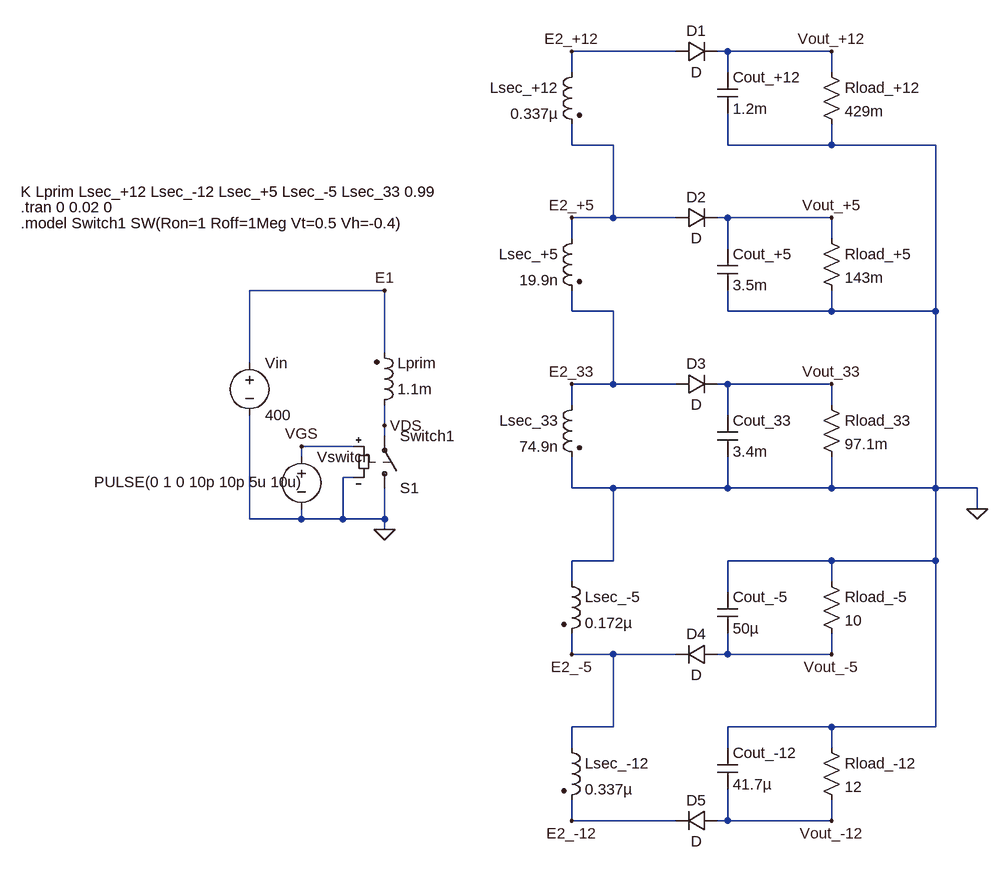
[diagram p0: schematic BasicFlyBack_AllRails_Stacked.asc]
BasicFlyBack_AllRails_Stacked.asc, the LTspice schematic file:
Version 4
SHEET 1 880 1456
WIRE 176 -208 16 -208
WIRE 256 -208 240 -208
WIRE 416 -208 256 -208
WIRE 16 -176 16 -208
WIRE 256 -176 256 -208
WIRE 416 -176 416 -208
WIRE 16 -64 16 -96
WIRE 80 -64 16 -64
WIRE 256 -64 256 -112
WIRE 416 -64 416 -96
WIRE 416 -64 256 -64
WIRE 576 -64 416 -64
WIRE 80 48 80 -64
WIRE 80 48 16 48
WIRE 176 48 80 48
WIRE 256 48 240 48
WIRE 416 48 256 48
WIRE 16 80 16 48
WIRE 416 80 416 48
WIRE 256 96 256 48
WIRE -272 160 -480 160
WIRE 16 192 16 160
WIRE 80 192 16 192
WIRE 256 192 256 160
WIRE 416 192 416 160
WIRE 416 192 256 192
WIRE 576 192 576 -64
WIRE 576 192 416 192
WIRE -272 256 -272 160
WIRE -480 272 -480 160
WIRE 80 304 80 192
WIRE 80 304 16 304
WIRE 176 304 80 304
WIRE 256 304 240 304
WIRE 416 304 256 304
WIRE 16 336 16 304
WIRE 416 336 416 304
WIRE 256 352 256 304
WIRE -272 368 -272 336
WIRE -272 384 -272 368
WIRE -320 400 -400 400
WIRE -400 416 -400 400
WIRE -320 448 -336 448
WIRE 16 464 16 416
WIRE 80 464 16 464
WIRE 256 464 256 416
WIRE 256 464 80 464
WIRE 416 464 416 416
WIRE 416 464 256 464
WIRE 576 464 576 192
WIRE 576 464 416 464
WIRE 640 464 576 464
WIRE 640 496 640 464
WIRE -480 512 -480 352
WIRE -400 512 -400 496
WIRE -400 512 -480 512
WIRE -336 512 -336 448
WIRE -336 512 -400 512
WIRE -272 512 -272 464
WIRE -272 512 -336 512
WIRE -272 528 -272 512
WIRE 80 576 80 464
WIRE 80 576 16 576
WIRE 416 576 256 576
WIRE 576 576 576 464
WIRE 576 576 416 576
WIRE 16 608 16 576
WIRE 416 608 416 576
WIRE 256 624 256 576
WIRE 16 720 16 688
WIRE 80 720 16 720
WIRE 176 720 80 720
WIRE 256 720 256 688
WIRE 256 720 240 720
WIRE 416 720 416 688
WIRE 416 720 256 720
WIRE 80 832 80 720
WIRE 80 832 16 832
WIRE 416 832 256 832
WIRE 576 832 576 576
WIRE 576 832 416 832
WIRE 16 864 16 832
WIRE 256 864 256 832
WIRE 416 864 416 832
WIRE 16 976 16 944
WIRE 176 976 16 976
WIRE 256 976 256 928
WIRE 256 976 240 976
WIRE 416 976 416 944
WIRE 416 976 256 976
FLAG -272 528 0
FLAG -272 160 E1
FLAG 16 -208 E2_+12
FLAG 16 48 E2_+5
FLAG 16 304 E2_33
FLAG 416 -208 Vout_+12
FLAG 416 48 Vout_+5
FLAG 416 304 Vout_33
FLAG -400 400 VGS
FLAG -272 368 VDS
FLAG 16 720 E2_-5
FLAG 416 720 Vout_-5
FLAG 16 976 E2_-12
FLAG 416 976 Vout_-12
FLAG 640 496 0
SYMBOL voltage -480 256 R0
SYMATTR InstName Vin
SYMATTR Value 400
SYMBOL ind2 -288 352 M180
WINDOW 0 36 80 Left 2
WINDOW 3 36 40 Left 2
SYMATTR InstName Lprim
SYMATTR Value 1.1m
SYMATTR Type ind
SYMATTR SpiceLine Rser=1m
SYMBOL ind2 32 -192 M0
SYMATTR InstName Lsec_+12
SYMATTR Value 0.337µ
SYMATTR Type ind
SYMATTR SpiceLine Rser=1m
SYMBOL ind2 32 64 M0
SYMATTR InstName Lsec_+5
SYMATTR Value 19.9n
SYMATTR Type ind
SYMATTR SpiceLine Rser=1m
SYMBOL ind2 32 320 M0
SYMATTR InstName Lsec_33
SYMATTR Value 74.9n
SYMATTR Type ind
SYMATTR SpiceLine Rser=1m
SYMBOL sw -272 480 M180
SYMATTR InstName S1
SYMATTR Value Switch1
SYMBOL voltage -400 400 R0
WINDOW 3 -319 55 Left 2
WINDOW 123 0 0 Left 0
WINDOW 39 0 0 Left 0
SYMATTR Value PULSE(0 1 0 10p 10p 5u 10u)
SYMATTR InstName Vswitch
SYMBOL res 400 -192 R0
SYMATTR InstName Rload_+12
SYMATTR Value 429m
SYMBOL res 400 64 R0
SYMATTR InstName Rload_+5
SYMATTR Value 143m
SYMBOL res 400 320 R0
SYMATTR InstName Rload_33
SYMATTR Value 97.1m
SYMBOL cap 240 352 R0
SYMATTR InstName Cout_33
SYMATTR Value 3.4m
SYMBOL cap 240 96 R0
SYMATTR InstName Cout_+5
SYMATTR Value 3.5m
SYMBOL cap 240 -176 R0
SYMATTR InstName Cout_+12
SYMATTR Value 1.2m
SYMBOL diode 176 -192 R270
WINDOW 0 32 32 VTop 2
WINDOW 3 0 32 VBottom 2
SYMATTR InstName D1
SYMBOL diode 176 64 R270
WINDOW 0 32 32 VTop 2
WINDOW 3 0 32 VBottom 2
SYMATTR InstName D2
SYMBOL diode 176 320 R270
WINDOW 0 32 32 VTop 2
WINDOW 3 0 32 VBottom 2
SYMATTR InstName D3
SYMBOL res 400 592 R0
SYMATTR InstName Rload_-5
SYMATTR Value 10
SYMBOL cap 240 624 R0
SYMATTR InstName Cout_-5
SYMATTR Value 50µ
SYMBOL diode 240 704 R90
WINDOW 0 0 32 VBottom 2
WINDOW 3 32 32 VTop 2
SYMATTR InstName D4
SYMBOL res 400 848 R0
SYMATTR InstName Rload_-12
SYMATTR Value 12
SYMBOL cap 240 864 R0
SYMATTR InstName Cout_-12
SYMATTR Value 41.7µ
SYMBOL diode 240 960 R90
WINDOW 0 0 32 VBottom 2
WINDOW 3 32 32 VTop 2
SYMATTR InstName D5
SYMBOL ind2 0 592 R0
SYMATTR InstName Lsec_-5
SYMATTR Value 0.172µ
SYMATTR Type ind
SYMBOL ind2 0 848 R0
SYMATTR InstName Lsec_-12
SYMATTR Value 0.337µ
SYMATTR Type ind
TEXT -832 8 Left 2 !K Lprim Lsec_+12 Lsec_-12 Lsec_+5 Lsec_-5 Lsec_33 0.99
TEXT -832 32 Left 2 !.tran 0 0.02 0
TEXT -832 56 Left 2 !.model Switch1 SW(Ron=1 Roff=1Meg Vt=0.5 Vh=-0.4)

The netlist it stands for:
* BasicFlyBack_AllRails_Stacked.asc
Vin E1 0 400
Lprim VDS E1 1.1m Rser=1m
Lsec_+12 E2_+12 E2_+5 0.337µ Rser=1m
Lsec_+5 E2_+5 E2_33 19.9n Rser=1m
Lsec_33 E2_33 0 74.9n Rser=1m
S1 0 VDS VGS 0 Switch1
Vswitch VGS 0 PULSE(0 1 0 10p 10p 5u 10u)
Rload_+12 Vout_+12 0 429m
Rload_+5 Vout_+5 0 143m
Rload_33 Vout_33 0 97.1m
Cout_33 Vout_33 0 3.4m
Cout_+5 Vout_+5 0 3.5m
Cout_+12 Vout_+12 0 1.2m
D1 E2_+12 Vout_+12 D
D2 E2_+5 Vout_+5 D
D3 E2_33 Vout_33 D
Rload_-5 0 Vout_-5 10
Cout_-5 0 Vout_-5 50µ
D4 Vout_-5 E2_-5 D
Rload_-12 0 Vout_-12 12
Cout_-12 0 Vout_-12 41.7µ
D5 Vout_-12 E2_-12 D
Lsec_-5 0 E2_-5 0.172µ
Lsec_-12 E2_-5 E2_-12 0.337µ
.model D D
.lib standard.dio
K Lprim Lsec_+12 Lsec_-12 Lsec_+5 Lsec_-5 Lsec_33 0.99
.tran 0 0.02 0
.model Switch1 SW(Ron=1 Roff=1Meg Vt=0.5 Vh=-0.4)
.backanno
.end